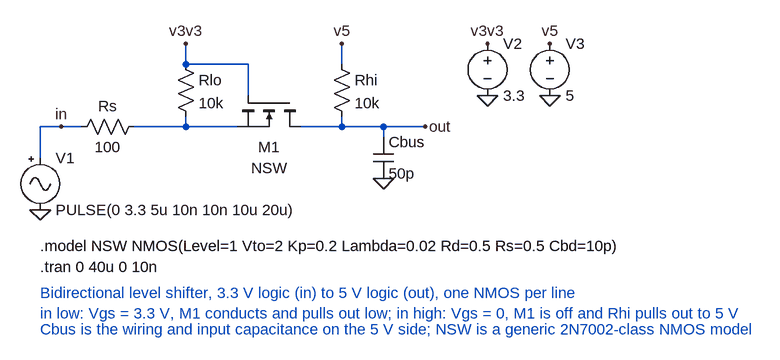
[diagram p0: schematic level_shifter.asc]
level_shifter.asc, the LTspice schematic file:
Version 4
SHEET 1 880 680
WIRE 256 96 256 128
WIRE 352 128 256 128
WIRE 352 176 352 128
WIRE 496 96 496 128
WIRE 32 224 32 272
WIRE 96 224 32 224
WIRE 256 224 176 224
WIRE 336 224 256 224
WIRE 256 224 256 208
WIRE 496 224 432 224
WIRE 560 224 496 224
WIRE 624 224 560 224
WIRE 496 224 496 208
WIRE 560 240 560 224
FLAG 256 96 v3v3
FLAG 496 96 v5
FLAG 32 352 0
FLAG 560 304 0
FLAG 64 224 in
FLAG 624 224 out
FLAG 720 96 v3v3
FLAG 720 176 0
FLAG 816 96 v5
FLAG 816 176 0
SYMBOL Misc\signal 32 256 R0
SYMATTR InstName V1
SYMATTR Value PULSE(0 3.3 5u 10n 10n 10u 20u)
SYMBOL res 192 208 R90
WINDOW 0 0 56 VBottom 2
WINDOW 3 32 56 VTop 2
SYMATTR InstName Rs
SYMATTR Value 100
SYMBOL res 240 112 R0
SYMATTR InstName Rlo
SYMATTR Value 10k
SYMBOL nmos 432 176 R90
WINDOW 0 64 48 VTop 2
WINDOW 3 96 48 VTop 2
SYMATTR InstName M1
SYMATTR Value NSW
SYMBOL res 480 112 R0
SYMATTR InstName Rhi
SYMATTR Value 10k
SYMBOL cap 544 240 R0
SYMATTR InstName Cbus
SYMATTR Value 50p
SYMBOL voltage 720 80 R0
SYMATTR InstName V2
SYMATTR Value 3.3
SYMBOL voltage 816 80 R0
SYMATTR InstName V3
SYMATTR Value 5
TEXT 32 408 Left 2 !.model NSW NMOS(Level=1 Vto=2 Kp=0.2 Lambda=0.02 Rd=0.5 Rs=0.5 Cbd=10p)
TEXT 32 440 Left 2 !.tran 0 40u 0 10n
TEXT 32 480 Left 2 ;Bidirectional level shifter, 3.3 V logic (in) to 5 V logic (out), one NMOS per line\nin low: Vgs = 3.3 V, M1 conducts and pulls out low; in high: Vgs = 0, M1 is off and Rhi pulls out to 5 V
TEXT 32 536 Left 2 ;Cbus is the wiring and input capacitance on the 5 V side; NSW is a generic 2N7002-class NMOS model

The netlist it stands for:
* level_shifter.asc
V1 in 0 PULSE(0 3.3 5u 10n 10n 10u 20u)
Rs N001 in 100
Rlo v3v3 N001 10k
M1 out v3v3 N001 N001 NSW
Rhi v5 out 10k
Cbus out 0 50p
V2 v3v3 0 3.3
V3 v5 0 5
.model NMOS NMOS
.model PMOS PMOS
.lib standard.mos
.model NSW NMOS(Level=1 Vto=2 Kp=0.2 Lambda=0.02 Rd=0.5 Rs=0.5 Cbd=10p)
.tran 0 40u 0 10n
* Bidirectional level shifter, 3.3 V logic (in) to 5 V logic (out), one NMOS per line
* in low: Vgs = 3.3 V, M1 conducts and pulls out low; in high: Vgs = 0, M1 is off and Rhi pulls out to 5 V
* Cbus is the wiring and input capacitance on the 5 V side; NSW is a generic 2N7002-class NMOS model
.backanno
.end